# Altium schematic sheet Chopper PMDC.SchDoc
size A3
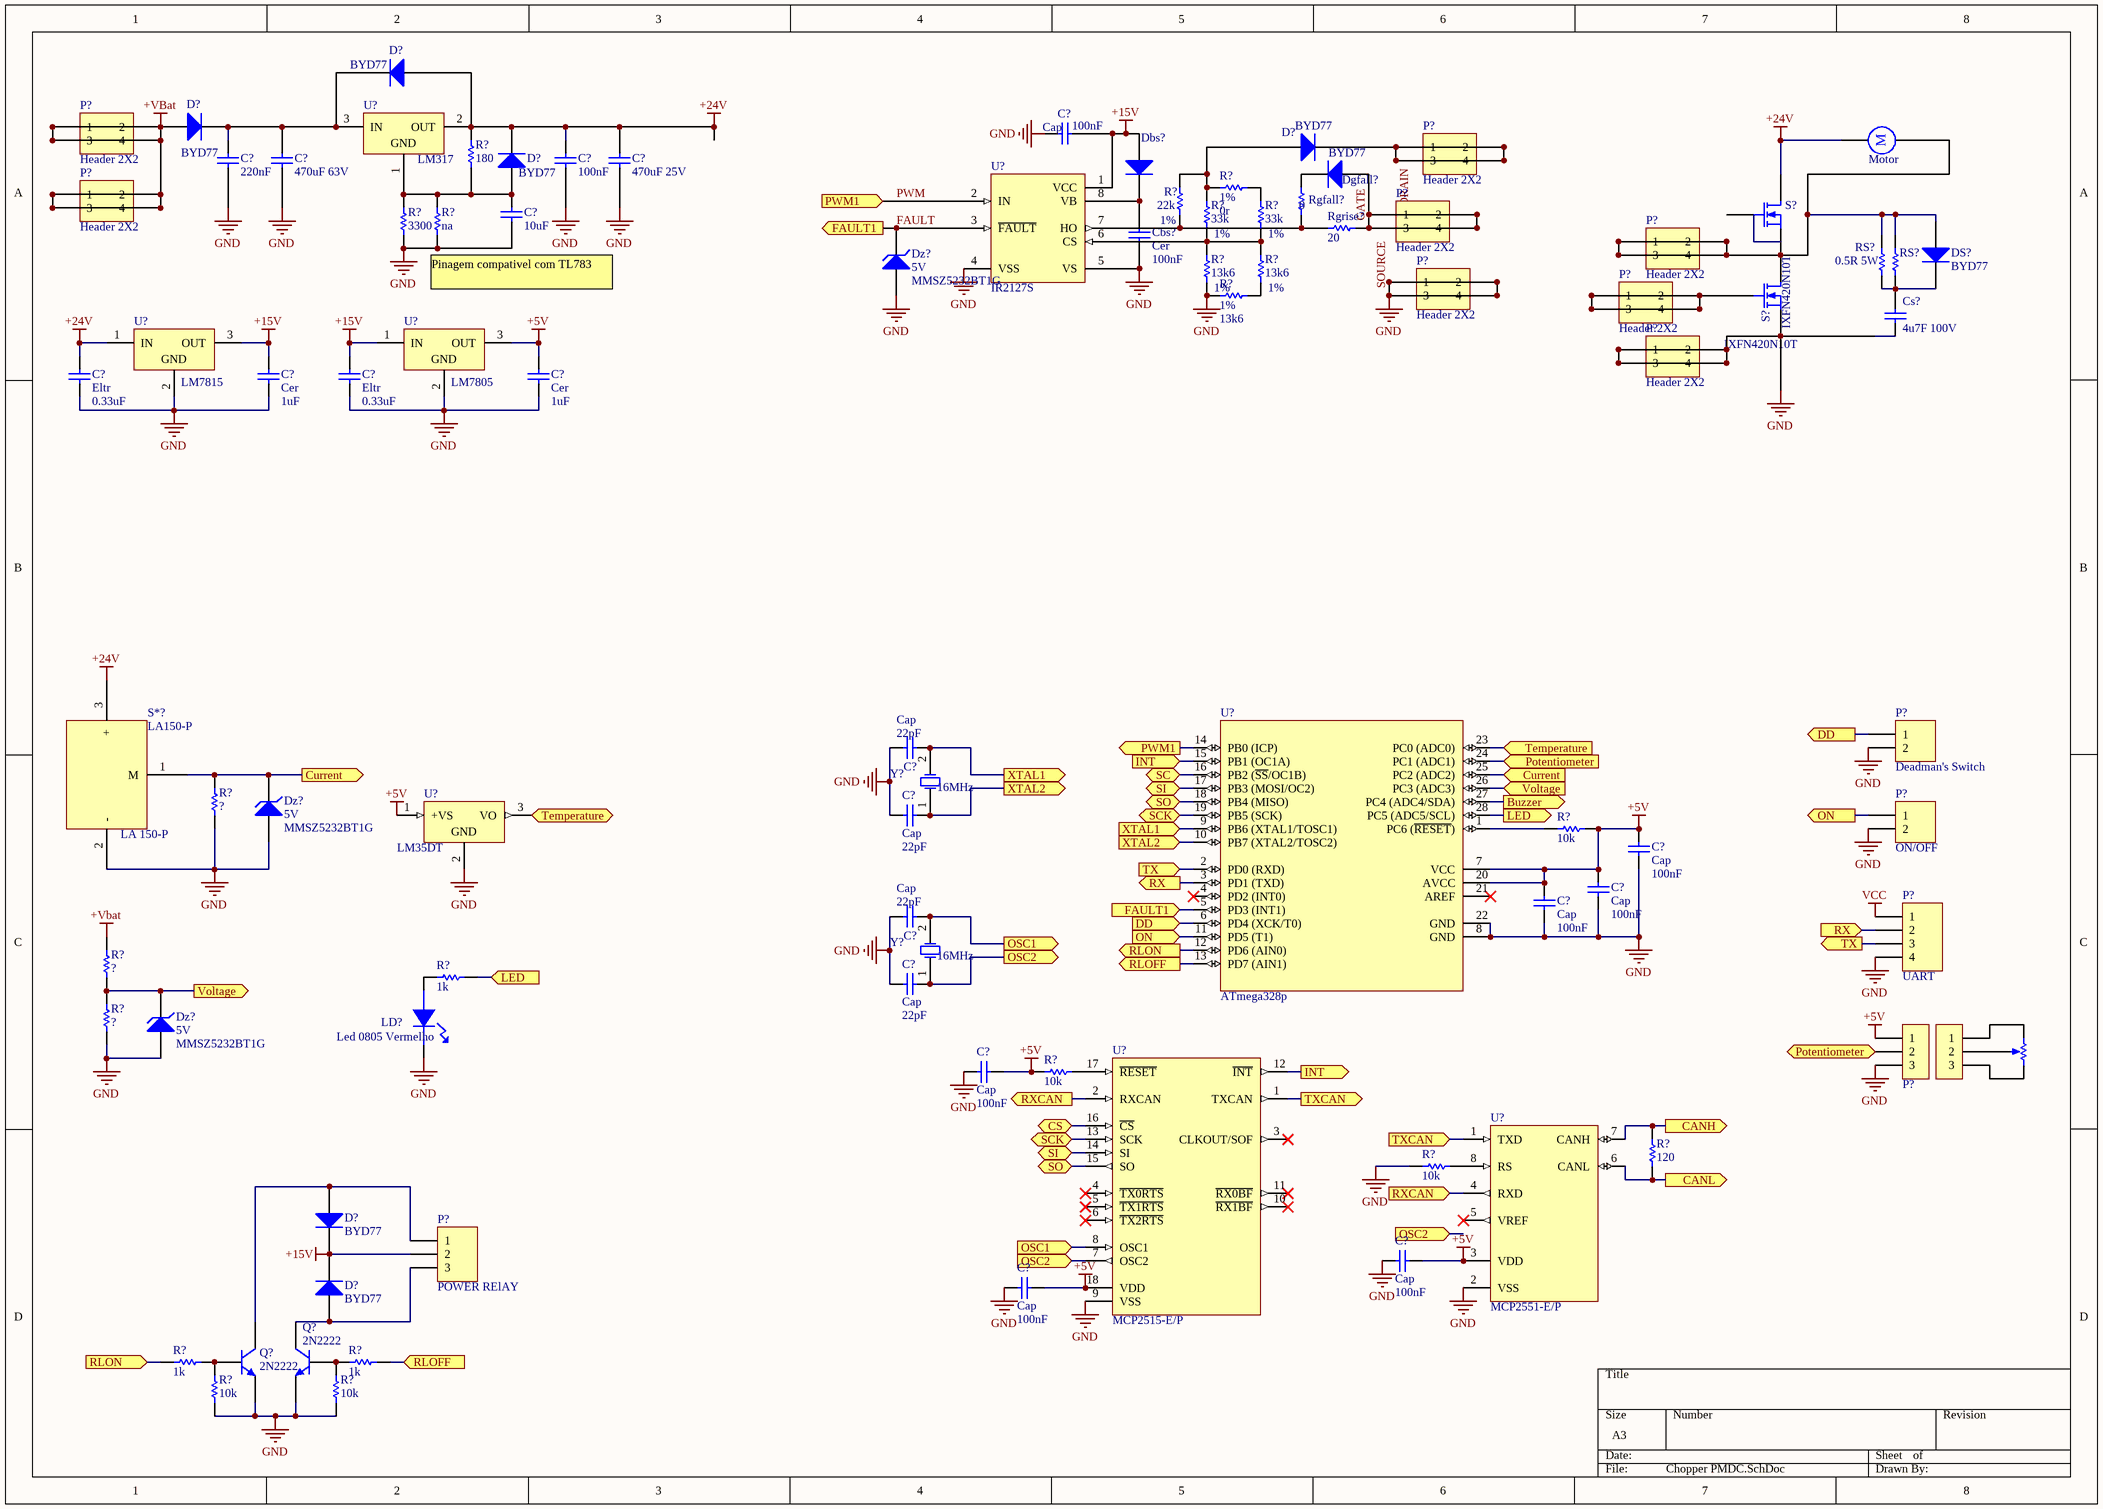
[diagram p0: Chopper PMDC.SchDoc]

## Parts
(Parts that share a designator on the sheet are numbered #1, #2 ... from top to bottom, then left to right.)
B?  Motor  [RB5-10.5]  (graphical)
C?#1  Cap  value 100nF  [6-0805_M]
C?#2  value 220nF  [6-0805_M]  (hidden comment: Cap)
C?#3  value 470uF 63V  [CapEltr-Rad6.6-Dpp4.5]  (hidden comment: Cap)
C?#4  value 100nF  [6-0805_M]  (hidden comment: Cap)
C?#5  value 470uF 25V  [CapEltr-Rad4.1-Dpp3.0]  (hidden comment: Cap)
C?#6  value 10uF  [6-0805_M]  (hidden comment: Cap)
C?#7  Eltr  value 0.33uF  [cap33n63v]
C?#8  Cer  value 1uF  [1u25v]
C?#9  Eltr  value 0.33uF  [cap33n63v]
C?#10  Cer  value 1uF  [1u25v]
C?#11  Cap  value 22pF  [CAPC3216L]
C?#12  Cap  value 22pF  [CAPC3216L]
C?#13  Cap  value 100nF  [6-0805_M]
C?#14  Cap  value 100nF  [6-0805_M]
C?#15  Cap  value 100nF  [6-0805_M]
C?#16  Cap  value 22pF  [CAPC3216L]
C?#17  Cap  value 22pF  [CAPC3216L]
C?#18  Cap  value 100nF  [6-0805_M]
C?#19  Cap  value 100nF  [6-0805_M]
C?#20  Cap  value 100nF  [6-0805_M]
Cbs?  Cer  value 100nF  [100nF]
Cs?  value 4u7F 100V  [Capacitor 4u7 100V]  (hidden comment: Cap)
D?#1  BYD77  [SOD87]
D?#2  value BYD77  [SOD87]  (hidden comment: Diode 1N4002)
D?#3  BYD77  [SOD87]
D?#4  value BYD77  [SOD87]  (hidden comment: 1N4002)
D?#5  value BYD77  [SOD87]  (hidden comment: 1N4002)
D?#6  value BYD77  [SOD87]  (hidden comment: 1N4002)
Dbs?  (no value)  [SOD87]
Dgfall?  BYD77  [SOD87]
DS?  BYD77  [SOD87]
Dz?#1  5V  value MMSZ5232BT1G  [ONSC-SOD-123FL-2-498_V]
Dz?#2  5V  value MMSZ5232BT1G  [ONSC-SOD-123FL-2-498_V]
Dz?#3  5V  value MMSZ5232BT1G  [ONSC-SOD-123FL-2-498_V]
LD?  value Led 0805 Vermelho  [6-0805_M]  (hidden comment: RED)
P?#1  Header 2X2  [HDR2X2]
P?#2  Header 2X2  [HDR2X2]
P?#3  Header 2X2  [HDR2X2]
P?#4  Header 2X2  [HDR2X2]
P?#5  Header 2X2  [HDR2X2]
P?#6  Header 2X2  [HDR2X2]
P?#7  Header 2X2  [HDR2X2]
P?#8  Header 2X2  [HDR2X2]
P?#9  Deadman's Switch  [HDR1X2]
P?#10  ON/OFF  [HDR1X2]
P?#11  UART  [HDR1X4]
P?#12  WE-Terminal Blocks Screw Type 691103110003  [t-block]  (value not drawn)
P?#13  WE-Terminal Blocks Screw Type 691103110003  [691103110003]  (value not drawn)  (graphical)
P?#14  POWER RElAY  [HDR1X3]
Q?#1  2N2222  [22-03]
Q?#2  2N2222  [22-03]
R?#1  value 180  [6-0805_M]  (hidden comment: Res1)
R?#2  1%  value 0r  [6-0805_M]
R?#3  1%  value 22k  [6-0805_M]
R?#4  1%  value 33k  [6-0805_M]
R?#5  1%  value 33k  [6-0805_M]
R?#6  value 3300  [6-0805_M]  (hidden comment: Res1)
R?#7  value na  [6-0805_M]  (hidden comment: Res1)
R?#8  1%  value 13k6  [6-0805_M]
R?#9  1%  value 13k6  [6-0805_M]
R?#10  1%  value 13k6  [6-0805_M]
R?#11  Res1  [6-0805_M]  (value not drawn)
R?#12  value 10k  [6-0805_M]  (hidden comment: Res1)
R?#13  Res1  [6-0805_M]  (value not drawn)
R?#14  value 1k  [6-0805_M]  (hidden comment: Res1)
R?#15  Res1  [6-0805_M]  (value not drawn)
R?#16  RPot  [VR5]  (value not drawn)  (graphical)
R?#17  value 10k  [6-0805_M]  (hidden comment: Res1)
R?#18  value 120  [6-0805_M]  (hidden comment: Res1)
R?#19  value 10k  [6-0805_M]  (hidden comment: Res1)
R?#20  value 1k  [6-0805_M]  (hidden comment: Res1)
R?#21  value 1k  [6-0805_M]  (hidden comment: Res1)
R?#22  value 10k  [6-0805_M]  (hidden comment: Res1)
R?#23  value 10k  [6-0805_M]  (hidden comment: Res1)
Rgfall?  value 0  [6-0805_M]  (hidden comment: Res1)
Rgrise?  value 20  [6-0805_M]  (hidden comment: Res1)
RS?#1  Res1  [Axial 0.8]  (value not drawn)
RS?#2  value 0.5R 5W  [Axial 0.8]  (hidden comment: Res1)
S*?  LA150-P  [LA150-P]
S?#1  IXFN420N10T  [SOT-227B]  (value not drawn)
S?#2  IXFN420N10T  [SOT-227B]
U?#1  LM317  [TO-220AB]
U?#2  IR2127S  [SO8_M]
U?#3  LM7815  [TO-220AB]
U?#4  LM7805  [TO-220AB]
U?#5  ATmega328p  [28P3]
U?#6  LM35DT  [TA03F]
U?#7  MCP2515-E/P  [PDIP300-P18]
U?#8  MCP2551-E/P  [PDIP300-P8]
Y?#1  16MHz  [BCY-W2/D3.1]
Y?#2  16MHz  [BCY-W2/D3.1]

## Ports
Buzzer (out), CANH (out), CANL (out), CS (bidir), Current (in), Current (out), DD (in), DD (out), FAULT1 (in), FAULT1 (out), INT (in), INT (out), LED (in), LED (out), ON (in), ON (out), OSC1 (in), OSC1 (out), OSC2 (in), OSC2 (out), Potentiometer (in), Potentiometer (out), PWM1 (in), PWM1 (out), RLOFF (in), RLOFF (out), RLON (in), RLON (out), RX (in), RX (out), RXCAN (in), RXCAN (out), SC (bidir), SCK (bidir), SI (bidir), SO (bidir), Temperature (in), Temperature (out), TX (in), TX (out), TXCAN (in), TXCAN (out), Voltage (in), Voltage (out), XTAL1 (in), XTAL1 (out), XTAL2 (in), XTAL2 (out)

## Nets
+5V: C?#10.2 C?#13.1 C?#14.1 C?#15.1 C?#18.2 C?#19.2 C?#20.2 P?#12.1 R?#12.2 R?#17.1 U?#4.3(OUT) U?#5.7(VCC) U?#5.20(AVCC) U?#6.1(+VS) U?#7.18(VDD) U?#8.3(VDD)
+15V: C?#1.1 C?#8.2 C?#9.2 D?#5.2(K) D?#6.2(K) Dbs?.1(A) P?#14.2 U?#2.1(VCC) U?#3.3(OUT) U?#4.1(IN)
+24V: B?.1 C?#4.2 C?#5.2 C?#7.2 D?#1.1(A) D?#4.2(K) R?#1.1 S*?.3(+) S?#1.1(D) U?#1.2(OUT) U?#3.1(IN)
+VBat: D?#2.1(A) P?#1.1 P?#1.2 P?#1.3 P?#1.4 P?#3.1 P?#3.2 P?#3.3 P?#3.4 R?#13.1
SOURCE: C?#1.2 C?#2.1 C?#3.1 C?#4.1 C?#5.1 C?#6.1 C?#7.1 C?#8.1 C?#9.1 C?#10.1 C?#11.1 C?#12.1 C?#13.2 C?#14.2 C?#15.2 C?#16.1 C?#17.1 C?#18.1 C?#19.1 C?#20.1 Cbs?.1 Cs?.1 Dz?#1.1(A) Dz?#2.1(A) Dz?#3.1(A) LD?.2 P?#6.1 P?#6.2 P?#6.3 P?#6.4 P?#8.1 P?#8.2 P?#8.3 P?#8.4 P?#9.2 P?#10.2 P?#11.4 P?#12.3 Q?#1.1(E) Q?#2.1(E) R?#6.1 R?#7.1 R?#8.2 R?#10.1 R?#11.2 R?#15.2 R?#19.1 R?#22.1 R?#23.1 S*?.2(-) S?#2.3(S) U?#2.4(VSS) U?#2.5(VS) U?#3.2(GND) U?#4.2(GND) U?#5.8(GND) U?#5.22(GND) U?#6.2(GND) U?#7.9(VSS) U?#8.2(VSS)  [also labelled GND]
VCC: P?#11.1
Buzzer: U?#5.27(PC4_(ADC4/SDA)) ; port Buzzer
CANH: R?#18.1 U?#8.7(CANH) ; port CANH
CANL: R?#18.2 U?#8.6(CANL) ; port CANL
CS: U?#7.16(~{CS}) ; port CS
Current: Dz?#2.2(K) R?#11.1 S*?.1(M) U?#5.25(PC2_(ADC2)) ; port Current
DD: P?#9.1 U?#5.6(PD4_(XCK/T0)) ; port DD
FAULT: Dz?#1.2(K) U?#2.3(~{FAULT}) U?#5.5(PD3_(INT1)) ; port FAULT1
GATE: Dgfall?.1(A) P?#4.1 P?#4.2 P?#4.3 P?#4.4 Rgrise?.1
INT: U?#5.15(PB1_(OC1A)) U?#7.12(~{INT}) ; port INT
LED: R?#14.1 U?#5.28(PC5_(ADC5/SCL)) ; port LED
ON: P?#10.1 U?#5.11(PD5_(T1)) ; port ON
OSC1: C?#16.2 U?#7.8(OSC1) Y?#2.2(OSC2) ; port OSC1
OSC2: C?#17.2 U?#7.7(OSC2) Y?#2.1(OSC1) ; port OSC2
Potentiometer: P?#12.2 U?#5.24(PC1_(ADC1)) ; port Potentiometer
PWM: U?#2.2(IN) U?#5.14(PB0_(ICP)) ; port PWM1
RLOFF: R?#21.2 U?#5.13(PD7_(AIN1)) ; port RLOFF
RLON: R?#20.1 U?#5.12(PD6_(AIN0)) ; port RLON
RX: P?#11.2 U?#5.3(PD1_(TXD)) ; port RX
RXCAN: U?#7.2(RXCAN) U?#8.4(RXD) ; port RXCAN
SC: U?#5.16(PB2_(~{SS}/OC1B)) ; port SC
SCK: U?#5.19(PB5_(SCK)) U?#7.13(SCK) ; port SCK
SI: U?#5.17(PB3_(MOSI/OC2)) U?#7.14(SI) ; port SI
SO: U?#5.18(PB4_(MISO)) U?#7.15(SO) ; port SO
Temperature: U?#5.23(PC0_(ADC0)) U?#6.3(VO) ; port Temperature
TX: P?#11.3 U?#5.2(PD0_(RXD)) ; port TX
TXCAN: U?#7.1(TXCAN) U?#8.1(TXD) ; port TXCAN
Voltage: Dz?#3.2(K) R?#13.2 R?#15.1 U?#5.26(PC3_(ADC3)) ; port Voltage
XTAL1: C?#11.2 U?#5.9(PB6_(XTAL1/TOSC1)) Y?#1.2(OSC2) ; port XTAL1
XTAL2: C?#12.2 U?#5.10(PB7_(XTAL2/TOSC2)) Y?#1.1(OSC1) ; port XTAL2
NetB?_2: B?.2 DS?.1(A) P?#5.1 P?#5.2 P?#5.3 P?#5.4 RS?#1.2 RS?#2.2 S?#1.3(S) S?#2.1(D)
NetC?#2_2: C?#2.2 C?#3.2 D?#1.2(K) D?#2.2(K) U?#1.3(IN)
NetC?#6_2: C?#6.2 D?#4.1(A) R?#1.2 R?#6.2 R?#7.2 U?#1.1(ADJ)
NetCbs?_2: Cbs?.2 Dbs?.2(K) U?#2.8(VB)
NetCs?_2: Cs?.2 DS?.2(K) RS?#1.1 RS?#2.1
NetD?#3_1: D?#3.1(A) R?#2.1 R?#3.1 R?#4.1
NetD?#3_2: D?#3.2(K) P?#2.1 P?#2.2 P?#2.3 P?#2.4
NetD?#5_1: D?#5.1(A) P?#14.1 Q?#1.3(C)
NetD?#6_1: D?#6.1(A) P?#14.3 Q?#2.3(C)
NetDgfall?_2: Dgfall?.2(K) Rgfall?.1
NetLD?_1: LD?.1 R?#14.2
NetP?#7_1: P?#7.1 P?#7.2 P?#7.3 P?#7.4 S?#2.2(G)
NetP?#13_1: P?#13.1 R?#16.1(TOP)
NetP?#13_2: P?#13.2 R?#16.3(TAP)
NetP?#13_3: P?#13.3 R?#16.2(BOT)
NetQ?#1_2: Q?#1.2(B) R?#20.2 R?#22.2
NetQ?#2_2: Q?#2.2(B) R?#21.1 R?#23.2
NetR?#2_2: R?#2.2 R?#5.1
NetR?#3_2: R?#3.2 Rgfall?.2 Rgrise?.2 U?#2.7(HO)
NetR?#4_2: R?#4.2 R?#5.2 R?#8.1 R?#9.1 U?#2.6(CS)
NetR?#9_2: R?#9.2 R?#10.2
NetR?#12_1: R?#12.1 U?#5.1(PC6_(~{RESET}))
NetR?#17_2: R?#17.2 U?#7.17(~{RESET})
NetR?#19_2: R?#19.2 U?#8.8(RS)

Not connected (* = marked no-connect by the designer): S?#1 2(G); U?#5 4(PD2_(INT0))* 21(AREF)*; U?#7 3(CLKOUT/SOF)* 4(~{TX0RTS})* 5(~{TX1RTS})* 6(~{TX2RTS})* 10(~{RX1BF})* 11(~{RX0BF})*; U?#8 5(VREF)*

## Notes on the sheet
- (near R?#7) Pinagem compativel com TL783
- Labels drawn without touching a wire or pin: DRAIN
- (in symbol L7805ACV) GND
- (in symbol LA150-P) LA 150-P
- (in symbol Motor) M

## Library data of the parts
B? = Motor: Motor, General Kind; Published: 24-Mar-1999; LatestRevisionDate: 17-Jul-2002; LatestRevisionNote: Re-released for DXP Platform.; PackageReference: RB5-10.5; Publisher: Altium Limited; PackageDescription: Capacitor (Radial); 2 Leads
C?#1-C?#10 C?#13-C?#15 C?#18-C?#20 Cbs? Cs? = Cap: Capacitor; Published: 8-Jun-2000; LatestRevisionDate: 17-Jul-2002; LatestRevisionNote: Re-released for DXP Platform.; PackageReference: RAD-0.3; Publisher: Altium Limited; PackageDescription: Radial Cap, Thru-Hole; 2 Leads; 0.3 in Pin Spacing
C?#11 C?#12 C?#16 C?#17 = Cap Semi: Capacitor (Semiconductor SIM Model); Published: 8-Jun-2000; LatestRevisionDate: 29-May-2009; LatestRevisionNote: IPC-7351 Footprint Added.; PackageReference: C1206; Publisher: Altium Limited; PackageDescription: Chip Capacitor
D?#1-D?#6 Dgfall? = Diode 1N4002: 1 Amp General Purpose Rectifier; pin to pad: 1>A 2>K
  D?#1: Published: 8-Jun-2000; LatestRevisionDate: 17-Jul-2002; LatestRevisionNote: Re-released for DXP Platform.; DatasheetVersion: 1998; PackageVersion: Aug-1999; PackageReference: DO-41; Publisher: Altium Limited; PackageDescription: Diode, Axial; Body 5.2 x 2.7 mm (LxDia. max), Lead Dia. 0.86 mm (max); Code_JEDEC: DO-204-AL; ComponentLink1Description: Manufacturer Link; ComponentLink1URL: http://www.fairchildsemi.com/; ComponentLink2Description: Datasheet; ComponentLink2URL: http://www.fairchildsemi.com/ds/1N%2F1N4001.pdf; value: BYD77
  D?#2 D?#4-D?#6: Published: 8-Jun-2000; LatestRevisionDate: 17-Jul-2002; LatestRevisionNote: Re-released for DXP Platform.; DatasheetVersion: 1998; PackageVersion: Aug-1999; PackageReference: DO-41; Publisher: Altium Limited; PackageDescription: Diode, Axial; Body 5.2 x 2.7 mm (LxDia. max), Lead Dia. 0.86 mm (max); Code_JEDEC: DO-204-AL; ComponentLink1Description: Manufacturer Link; ComponentLink1URL: http://www.fairchildsemi.com/; ComponentLink2Description: Datasheet; ComponentLink2URL: http://www.fairchildsemi.com/ds/1N%2F1N4001.pdf
  D?#3 Dgfall?: value: BYD77
Dbs? = Diode 1N4002: 1 Amp General Purpose Rectifier; pin to pad: 1>A 2>K; value: BYD77
DS? = Diode: Default Diode; pin to pad: 1>A 2>K; Published: 8-Jun-2000; LatestRevisionDate: 17-Jul-2002; LatestRevisionNote: Re-released for DXP Platform.; PackageVersion: Sep-1996; PackageReference: SMC; Publisher: Altium Limited; PackageDescription: DO-214-AB/SMC; 2 C-Bend Leads; Body 7.9 x 5.9 mm, inc. leads (LxW); Code_JEDEC: DO-214-AB; value: BYD77
Dz?#1-Dz?#3 = D Zener: Zener Diode
LD? = LED: Diodo Emissor de Luz
P?#1-P?#8 = Header 2X2: Header, 2-Pin, Dual row; LatestRevisionDate: 17-Jul-2002; LatestRevisionNote: Re-released for DXP Platform.; Publisher: Altium Limited
P?#9 P?#10 = Header 2: Header, 2-Pin; LatestRevisionDate: 17-Jul-2002; LatestRevisionNote: Re-released for DXP Platform.; Publisher: Altium Limited
P?#11 = Header 4: Header, 4-Pin; LatestRevisionDate: 17-Jul-2002; LatestRevisionNote: Re-released for DXP Platform.; Publisher: Altium Limited
P?#12 P?#13 = WE-Terminal Blocks Screw Type 691103110003: WR-TBL 3.50 mm Wire Protector system; Manufacturer: Würth Elektronik eiSos GmbH; ComponentLink1 Description: Manufacturer; ComponentLink2 Description: Datasheet; NoPins: 3; value: 3 pin Screw Terminal Block; Created Date: 29 October 2013; partNo: 691103110003; ComponentLink1URL: http://www.we-online.com; ComponentLink2URL: http://katalog.we-online.de/em/datasheet/6911031100xx.pdf; Created by: Karrer Zheng
P?#14 = Header 3: Header, 3-Pin; LatestRevisionDate: 17-Jul-2002; LatestRevisionNote: Re-released for DXP Platform.; Publisher: Altium Limited
Q?#1 Q?#2 = 2N2222: General Purpose Transistor NPN Silicon; Published: 29-Sep-2000; LatestRevisionDate: 17-Jul-2002; LatestRevisionNote: Re-released for DXP Platform.; DatasheetVersion: 1991; PackageVersion: 1997; PackageReference: 22-03; Publisher: Altium Limited; PackageDescription: Can; 3 Leads; Pin Circle Dia. 2.54 mm; Lead Dia. 0.48 mm (max); ComponentLink1Description: Manufacturer Link; ComponentLink1URL: http://www.onsemi.com/site/products/landing?taxonomyID=194
R?#1-R?#15 R?#17-R?#23 Rgfall? Rgrise? RS?#1 RS?#2 = Res1: Resistor; Published: 8-Jun-2000; LatestRevisionDate: 17-Jul-2002; LatestRevisionNote: Re-released for DXP Platform.; PackageReference: AXIAL-0.3; Publisher: Altium Limited; PackageDescription: Axial Device, Thru-Hole; 2 Leads; 0.3 in Pin Spacing
  R?#11 R?#13 R?#15: Value: ?
R?#16 = RPot: Potentiometer; Sim Note: Enter the Resistance value and the set point into parameter fields.; Set Position: 0.5; Value: 1K; Published: 8-Jun-2000; LatestRevisionDate: 17-Jul-2002; LatestRevisionNote: Re-released for DXP Platform.; PackageReference: VR5; Publisher: Altium Limited; PackageDescription: Variable Resistor, Thru-Hole; 3 Leads
S*? = LA150-P: Current Transducer
S?#1 S?#2 = MOSFET-N: N-Channel MOSFET; pin to pad: 1>3 3>1; Published: 8-Jun-2000; LatestRevisionDate: 17-Jul-2002; LatestRevisionNote: Re-released for DXP Platform.; PackageVersion: 1995/1996; PackageReference: E3; Publisher: Altium Limited; PackageDescription: TO, Flat Index; 3 In-Line, Axial Leads; Body Dia. 4.6mm; Lead Dia. 0.5 mm (max); value: IXFN420N10T
U?#1 = L7805ACV: Precision 1A Regulator; Note: Tab is connected to pin 3 (GND).; value: LT783; Published: 24-Aug-2001; LatestRevisionDate: 17-Jul-2002; LatestRevisionNote: Re-released for DXP Platform.; DatasheetVersion: Nov-1999; PackageVersion: Jun-1998; PackageReference: TO220ABN; Publisher: Altium Limited; PackageDescription: TO, Thru-Hole, Vertical, Heatsink Mounted; 3 In-Line Leads; Pitch 2.54 mm; Pin sequence 1, 3, 2; ComponentLink1Description: Manufacturer Link; ComponentLink1URL: http://www.st.com/; ComponentLink2Description: Datasheet; ComponentLink2URL: http://www.st.com/stonline/products/literature/ds/2144/l7805ab.pdf
U?#2 = IR2127S: Current Sensing Single Channel Driver; Published: 8-Jun-2000; LatestRevisionDate: 13-Apr-2006; LatestRevisionNote: IPC-7351 Footprint Added.; DatasheetVersion: PD60143J; PackageVersion: Feb-2001; PackageReference: SO-8; Publisher: Altium Limited; PackageDescription: 8-Pin Plastic Small Outline Integrated Circuit 1.27 mm Pitch; Code_JEDEC: MS-012-AA; Code_IPC: SOIC127P600-8; ComponentLink1Description: Manufacturer Link; ComponentLink1URL: http://www.irf.com/; ComponentLink2Description: Datasheet; ComponentLink2URL: http://www.irf.com/product-info/datasheets/data/ir2127.pdf; value: IR2127S
U?#3 U?#4 = µA7805CKC: Positive-Voltage Regulator; Note: Pin 2 is electrically connected to TAB.; Published: 15-Apr-2002; DatasheetVersion: Jul-1999; PackageVersion: Sep-1995; PackageReference: KC03; Publisher: Altium Limited; PackageDescription: TO, Thru-Hole, Vertical, Heatsink Mounted; 3 In-Line Leads; Pitch 2.54 mm; ComponentLink1Description: Manufacturer Link; ComponentLink1URL: http://www.ti.com/; ComponentLink2Description: Datasheet; ComponentLink2URL: http://www-s.ti.com/sc/ds/ua7805.pdf
U?#5 = ATmega8-16PI: 8-Bit AVR Microcontroller with 8K Bytes of In-System Programmable Flash Memory; Published: 17-Sep-2003; LatestRevisionDate: 04-Mar-2005; LatestRevisionNote: Stylized 3D Model Added.; DatasheetVersion: 2486H-AVR-09/02; PackageVersion: revB, Sep-2001; PackageReference: 28P3; Publisher: Altium Limited; PackageDescription: DIP; 28 Leads; Row Spacing 7.62 mm; Pitch 2.54 mm; ComponentLink1Description: Manufacturer Link; ComponentLink1URL: http://www.atmel.com; ComponentLink2Description: Datasheet; ComponentLink2URL: http://www.atmel.com/dyn/resources/prod_documents/doc2486.pdf
U?#6 = LM35DT: Precision Centigrade Temperature Sensor; Manufacturer: National Semiconductor; CompType: Temp Sensor IC; PackageTopMarking: NSUZXYTTE#*LM35DT; PowerWise: N; Published: 4-Dec-2008; DatasheetVersion: Nov-2000; PackageVersion: revL, Jan-1993; PackageReference: TA03F; Publisher: Altium Limited; PackageDescription: TO-220, Molded, 3 Lead, Auto L/F; PartNumber: LM35DT; RoHS: O; PinCount: 3; DigiKeyPartNumber: LM35DT-ND; Code_JEDEC: TO-220-AB; ComponentLink1Description: LM35 Datasheet; ComponentLink1URL: http://www.national.com/ds/LM/LM35.pdf; ComponentLink2Description: LM35 Web Page; ComponentLink2URL: http://www.national.com/pf/LM/LM35.html; ComponentLink3Description: TA03F Package Page; ComponentLink3URL: http://www.national.com/packaging/folders/ta03f.html
U?#7 = MCP2515-E/P: Stand-Alone CAN Controller With SPI Interface, 18-Pin PDIP, Extended Temperature; FirstPublished: 29-Jan-2009; DatasheetVersion: revE, Nov-2007; PackageVersion: revBB, Aug-2009; PackageReference: PDIP300-P18; Publisher: Altium Limited; PackageDescription: 18-Lead Plastic Dual In-Line (P) - 300 mil Body [PDIP]; Supplier 1: Digi-Key; Supplier Part Number 1: MCP2515-E/P-ND; Supplier 2: Newark; Supplier Part Number 2: 29H7133; Code_JEDEC: MS-001; ComponentLink1Description: Datasheet; ComponentLink1URL: http://ww1.microchip.com/downloads/en/DeviceDoc/21801e.pdf; ComponentLink2Description: Packaging Specification; ComponentLink2URL: http://www.microchip.com/stellent/groups/techpub_sg/documents/packagingspec/en012702.pdf; ComponentLink3Description: Microchip.com Home; ComponentLink3URL: http://www.microchip.com/
U?#8 = MCP2551-E/P: High-Speed CAN Transceiver, 8-Pin PDIP, Extended Temperature; FirstPublished: 29-Jan-2009; DatasheetVersion: revE, Jan-2007; PackageVersion: revBB, Aug-2009; PackageReference: PDIP300-P8; Publisher: Altium Limited; PackageDescription: 8-Lead Plastic Dual In-Line (P) - 300 mil Body [PDIP]; Supplier 1: Digi-Key; Supplier Part Number 1: MCP2551-E/P-ND; Supplier 2: Farnell; Supplier Part Number 2: 1439745; Supplier 3: Newark; Supplier Part Number 3: 69K7603; Code_JEDEC: MS-001; ComponentLink1Description: Datasheet; ComponentLink1URL: http://ww1.microchip.com/downloads/en/DeviceDoc/21667E.pdf; ComponentLink2Description: Packaging Specification; ComponentLink2URL: http://www.microchip.com/stellent/groups/techpub_sg/documents/packagingspec/en012702.pdf; ComponentLink3Description: Microchip.com Home; ComponentLink3URL: http://www.microchip.com/
Y?#1 Y?#2 = XTAL: Crystal Oscillator; Published: 8-Jun-2000; LatestRevisionDate: 17-Jul-2002; LatestRevisionNote: Re-released for DXP Platform.; PackageReference: R38; Publisher: Altium Limited